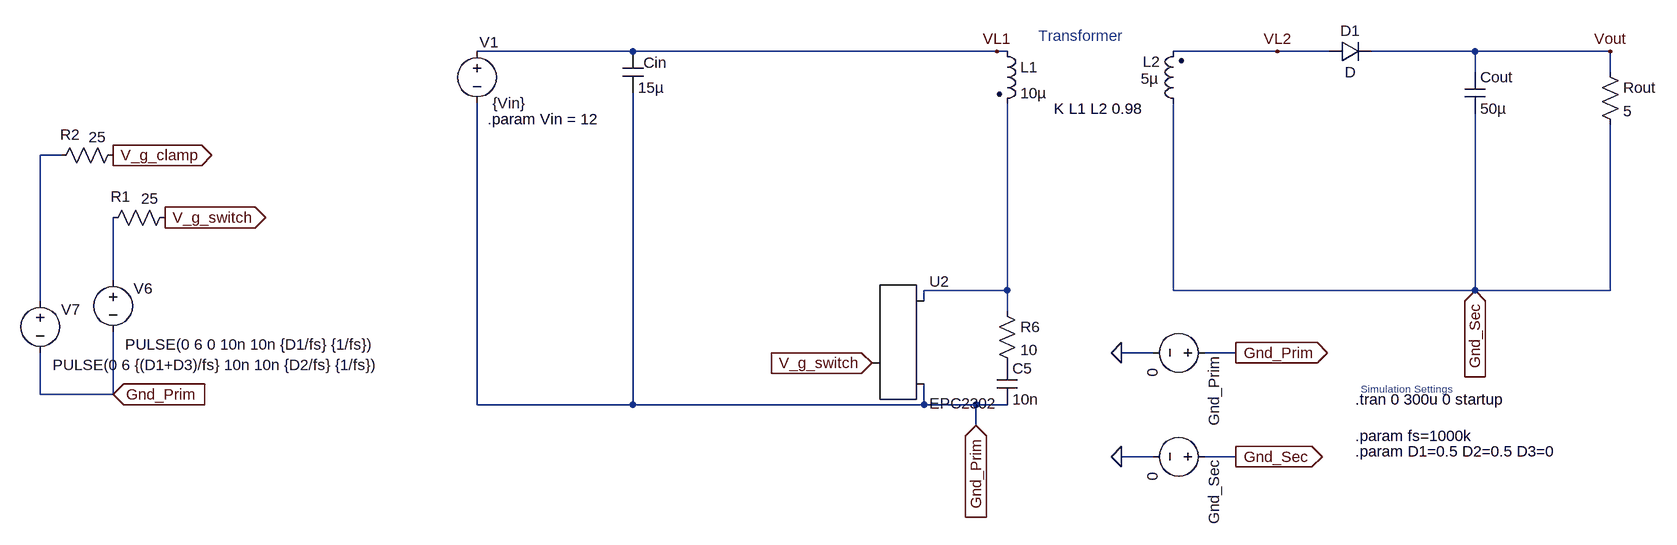
[diagram p0: schematic Flyback VF2.asc]
Flyback VF2.asc, the LTspice schematic file:
Version 4
SHEET 1 1908 1128
WIRE -496 -288 -736 -288
WIRE 64 -288 -496 -288
WIRE 80 -288 64 -288
WIRE 496 -288 336 -288
WIRE 576 -288 496 -288
WIRE 800 -288 640 -288
WIRE 1008 -288 800 -288
WIRE 800 -256 800 -288
WIRE 1008 -256 1008 -288
WIRE -1376 -128 -1408 -128
WIRE -1296 64 -1296 -32
WIRE 80 80 80 -208
WIRE 80 80 -48 80
WIRE 336 80 336 -208
WIRE 800 80 800 -192
WIRE 800 80 336 80
WIRE 1008 80 1008 -176
WIRE 1008 80 800 80
WIRE -1408 96 -1408 -128
WIRE -48 96 -48 80
WIRE 80 112 80 80
WIRE 304 176 256 176
WIRE 432 176 384 176
WIRE -1408 240 -1408 176
WIRE -1296 240 -1296 144
WIRE -1296 240 -1408 240
WIRE -736 256 -736 -208
WIRE -496 256 -496 -224
WIRE -496 256 -736 256
WIRE -48 256 -48 224
WIRE -48 256 -496 256
WIRE 32 256 -48 256
WIRE 80 256 32 256
WIRE 32 288 32 256
WIRE 304 336 256 336
WIRE 432 336 384 336
FLAG 1008 -288 Vout
FLAG 64 -288 VL1
FLAG 496 -288 VL2
FLAG 256 176 0
FLAG 432 176 Gnd_Prim
IOPIN 432 176 Out
FLAG 256 336 0
FLAG 432 336 Gnd_Sec
IOPIN 432 336 Out
FLAG 32 288 Gnd_Prim
IOPIN 32 288 In
FLAG 800 80 Gnd_Sec
IOPIN 800 80 In
FLAG -1216 -32 V_g_switch
IOPIN -1216 -32 Out
FLAG -1296 240 Gnd_Prim
IOPIN -1296 240 In
FLAG -1296 -128 V_g_clamp
IOPIN -1296 -128 Out
FLAG -128 192 V_g_switch
IOPIN -128 192 In
SYMBOL ind2 64 -304 R0
SYMATTR InstName L1
SYMATTR Value 10µ
SYMBOL ind2 352 -192 R180
WINDOW 0 36 80 Left 2
WINDOW 3 39 54 Left 2
SYMATTR InstName L2
SYMATTR Value 5µ
SYMBOL voltage -736 -304 R0
WINDOW 123 0 0 Left 0
WINDOW 39 24 44 Left 2
WINDOW 0 4 2 Left 2
SYMATTR InstName V1
SYMATTR Value {Vin}
SYMBOL res 992 -272 R0
SYMATTR InstName Rout
SYMATTR Value 5
SYMBOL cap 784 -256 R0
SYMATTR InstName Cout
SYMATTR Value 50µ
SYMBOL cap -512 -288 R0
WINDOW 0 32 17 Left 2
SYMATTR InstName Cin
SYMATTR Value 15µ
SYMBOL EPCGaN -128 192 R0
SYMATTR InstName U2
SYMATTR Value EPC2302
SYMBOL res 64 96 R0
SYMATTR InstName R6
SYMATTR Value 10
SYMBOL cap 64 192 R0
SYMATTR InstName C5
SYMATTR Value 10n
SYMBOL voltage 400 176 R90
WINDOW 123 0 0 Left 0
WINDOW 39 24 44 Left 2
WINDOW 0 4 2 Left 2
SYMATTR InstName Gnd_Prim
SYMATTR Value 0
SYMBOL voltage 400 336 R90
WINDOW 123 0 0 Left 0
WINDOW 39 24 44 Left 2
WINDOW 0 4 2 Left 2
SYMATTR InstName Gnd_Sec
SYMATTR Value 0
SYMBOL voltage -1296 48 R0
WINDOW 123 0 0 Left 0
WINDOW 39 0 0 Left 0
WINDOW 3 19 115 Left 2
WINDOW 0 32 29 Left 2
SYMATTR Value PULSE(0 6 0 10n 10n {D1/fs} {1/fs})
SYMATTR InstName V6
SYMBOL voltage -1408 80 R0
WINDOW 123 0 0 Left 0
WINDOW 39 0 0 Left 0
WINDOW 3 19 115 Left 2
WINDOW 0 32 29 Left 2
SYMATTR Value PULSE(0 6 {(D1+D3)/fs} 10n 10n {D2/fs} {1/fs})
SYMATTR InstName V7
SYMBOL res -1200 -48 R90
WINDOW 0 -1 84 VBottom 2
WINDOW 3 -29 39 VTop 2
SYMATTR InstName R1
SYMATTR Value 25
SYMBOL res -1280 -144 R90
WINDOW 0 0 82 VBottom 2
WINDOW 3 -28 40 VTop 2
SYMATTR InstName R2
SYMATTR Value 25
SYMBOL diode 576 -272 R270
WINDOW 0 32 32 VTop 2
WINDOW 3 0 32 VBottom 2
SYMATTR InstName D1
TEXT 152 -200 Left 2 !K L1 L2 0.98
TEXT -720 -184 Left 2 !.param Vin = 12
TEXT 616 248 Left 2 !.tran 0 300u 0 startup
TEXT 616 304 Left 2 !.param fs=1000k
TEXT 616 328 Left 2 !.param D1=0.5 D2=0.5 D3=0
TEXT 128 -312 Left 2 ;Transformer
TEXT 624 232 Left 1 ;Simulation Settings

The netlist it stands for:
* Flyback VF2.asc
L1 VL1 N003 10µ
L2 Gnd_Sec VL2 5µ
V1 VL1 Gnd_Prim {Vin}
Rout Vout Gnd_Sec 5
Cout Vout Gnd_Sec 50µ
Cin VL1 Gnd_Prim 15µ
XU2 V_g_switch N003 Gnd_Prim EPC2302
R6 N003 P001 10
C5 P001 Gnd_Prim 10n
V§Gnd_Prim Gnd_Prim 0 0
V§Gnd_Sec Gnd_Sec 0 0
V6 N002 Gnd_Prim PULSE(0 6 0 10n 10n {D1/fs} {1/fs})
V7 N001 Gnd_Prim PULSE(0 6 {(D1+D3)/fs} 10n 10n {D2/fs} {1/fs})
R1 V_g_switch N002 25
R2 V_g_clamp N001 25
D1 VL2 Vout D
.model D D
.lib standard.dio
K L1 L2 0.98
.param Vin = 12
.tran 0 300u 0 startup
.param fs=1000k
.param D1=0.5 D2=0.5 D3=0
* Transformer
* Simulation Settings
.backanno
.end